# EAGLE schematic Enclosure 100x68 GPSJ (EAGLE 9.6.2)
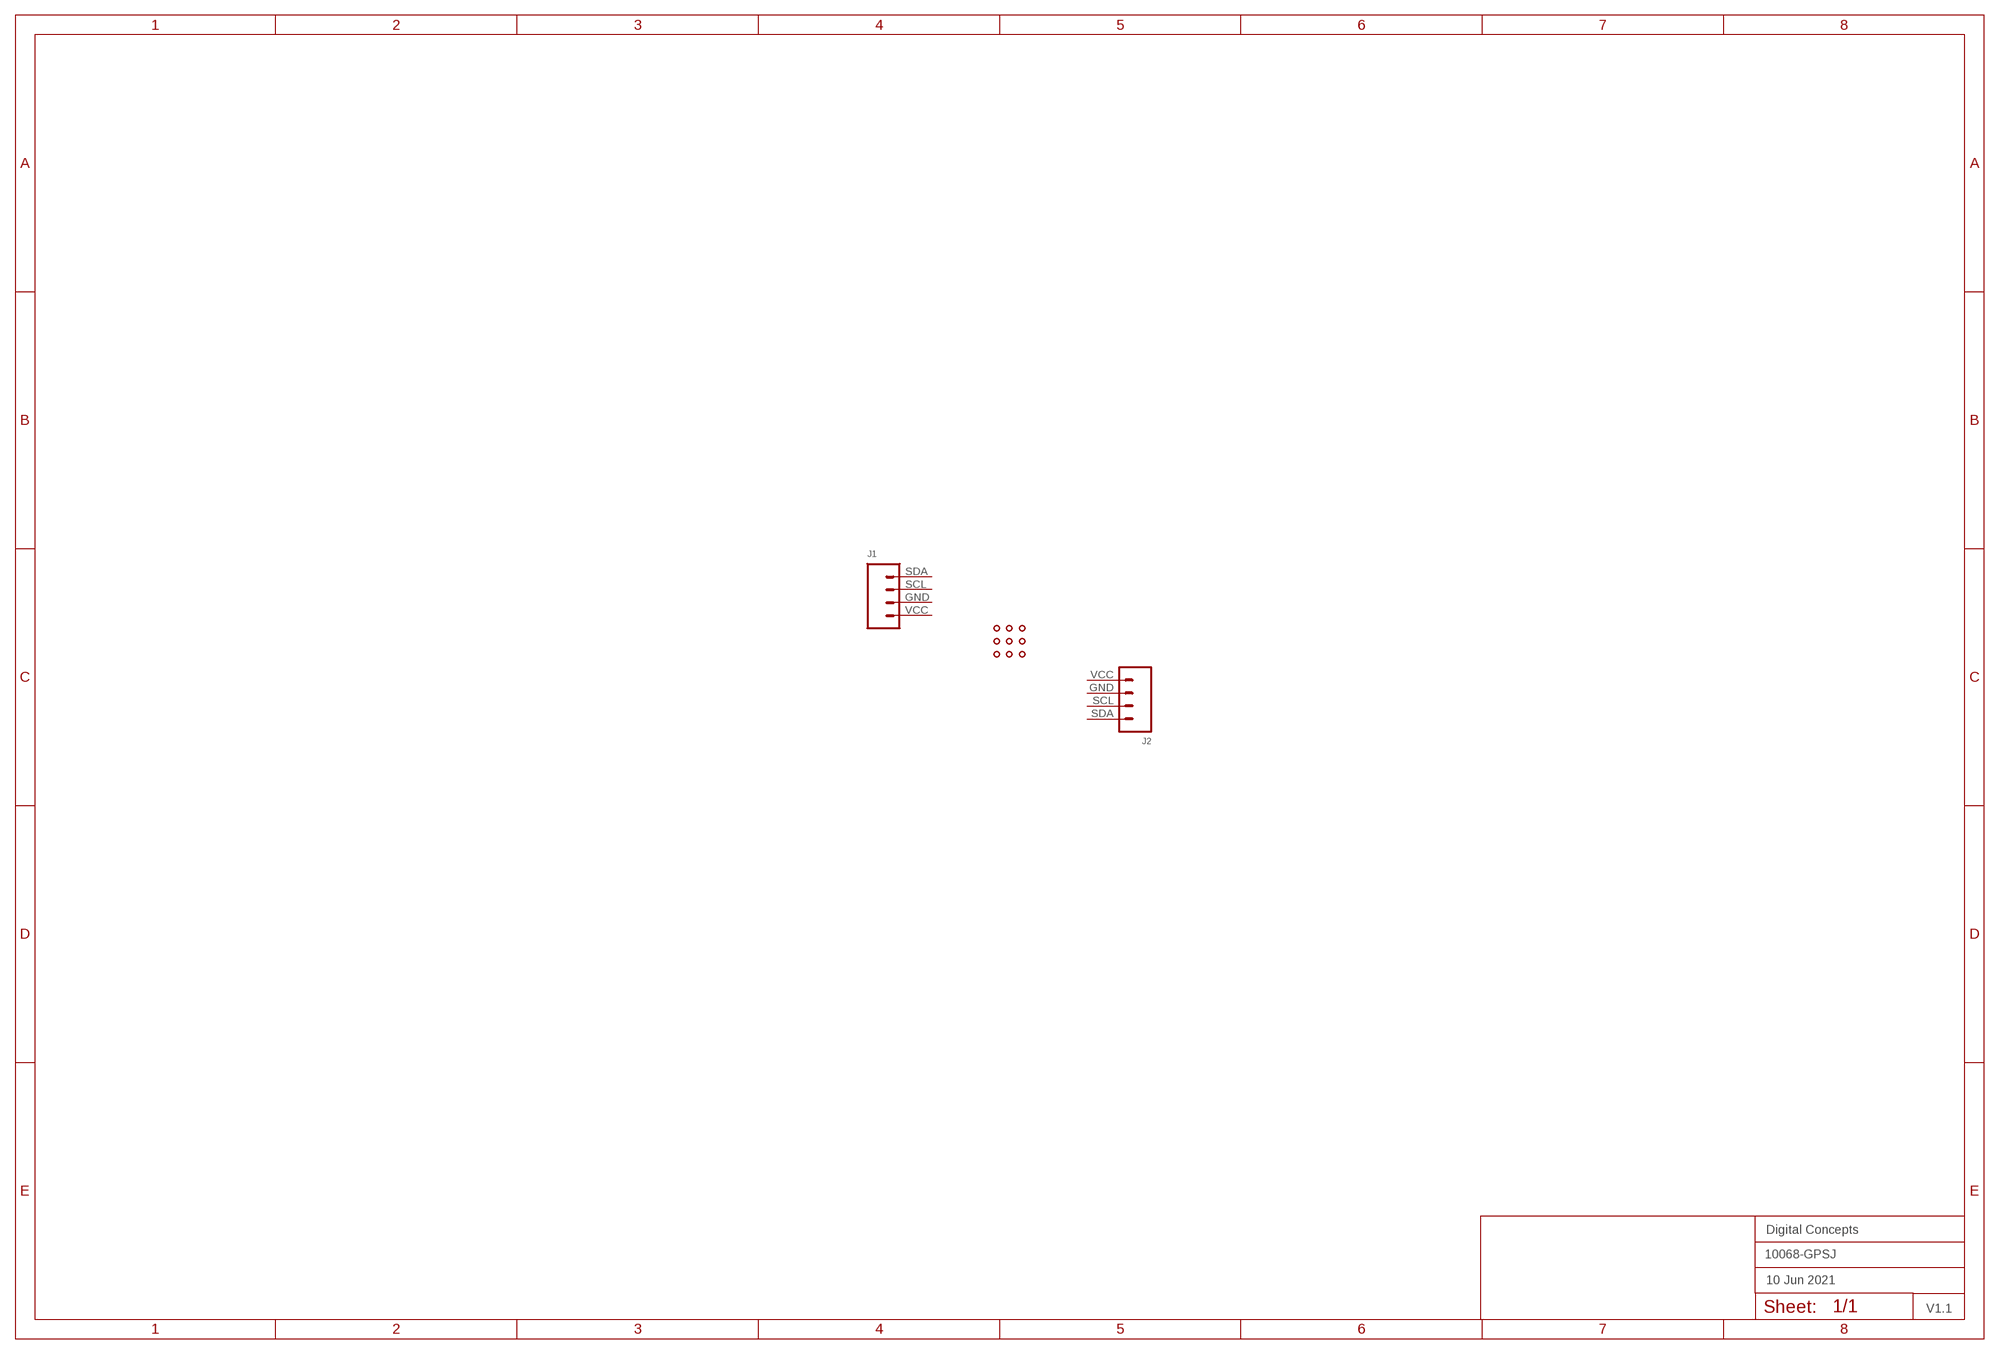
[diagram p0: schematic, sheet 1]
FRAME2 (A3L-LOC): DATE: 10 Jun 2021; OWNER: Digital Concepts; TITLE: 10068-GPSJ; VERSION: V1.1

## Parts
J1  JST-PH2.0-I2C-MALE-HORIZONTAL  [JST-PH2.0-4-HORIZONTAL]
J2  JST-PH2.0-I2C-MALE-HORIZONTAL  [JST-PH2.0-4-HORIZONTAL]
U$1  PROTO-34X22-GPS-I2C  [PROTO-34X22-GPS-I2C]
Unconnected: J1.GND J1.SCL J1.SDA J1.VCC J2.GND J2.SCL J2.SDA J2.VCC

## Library data of the parts
J1 J2 = digitalconcepts:JST-PH2.0-I2C-MALE-HORIZONTAL: PH2.0 4P (I2C) Right Angle PCB Connector
U$1 = digitalconcepts:PROTO-34X22-GPS-I2C: 34 x 22 Prototyping board to fit an 100 x 68 enclosure With GPS antenna mount and I2C Interface